# EasyEDA Pro project rocker.eprj

# Schematic Schematic1
Create Date: 2024-03-17; Page Name: P1; Project Name: 1919810; Schematic Name: Schematic1; Update Date: 2024-03-17; Company: 嘉立创EDA; Page Size: A4; Version: V1.0
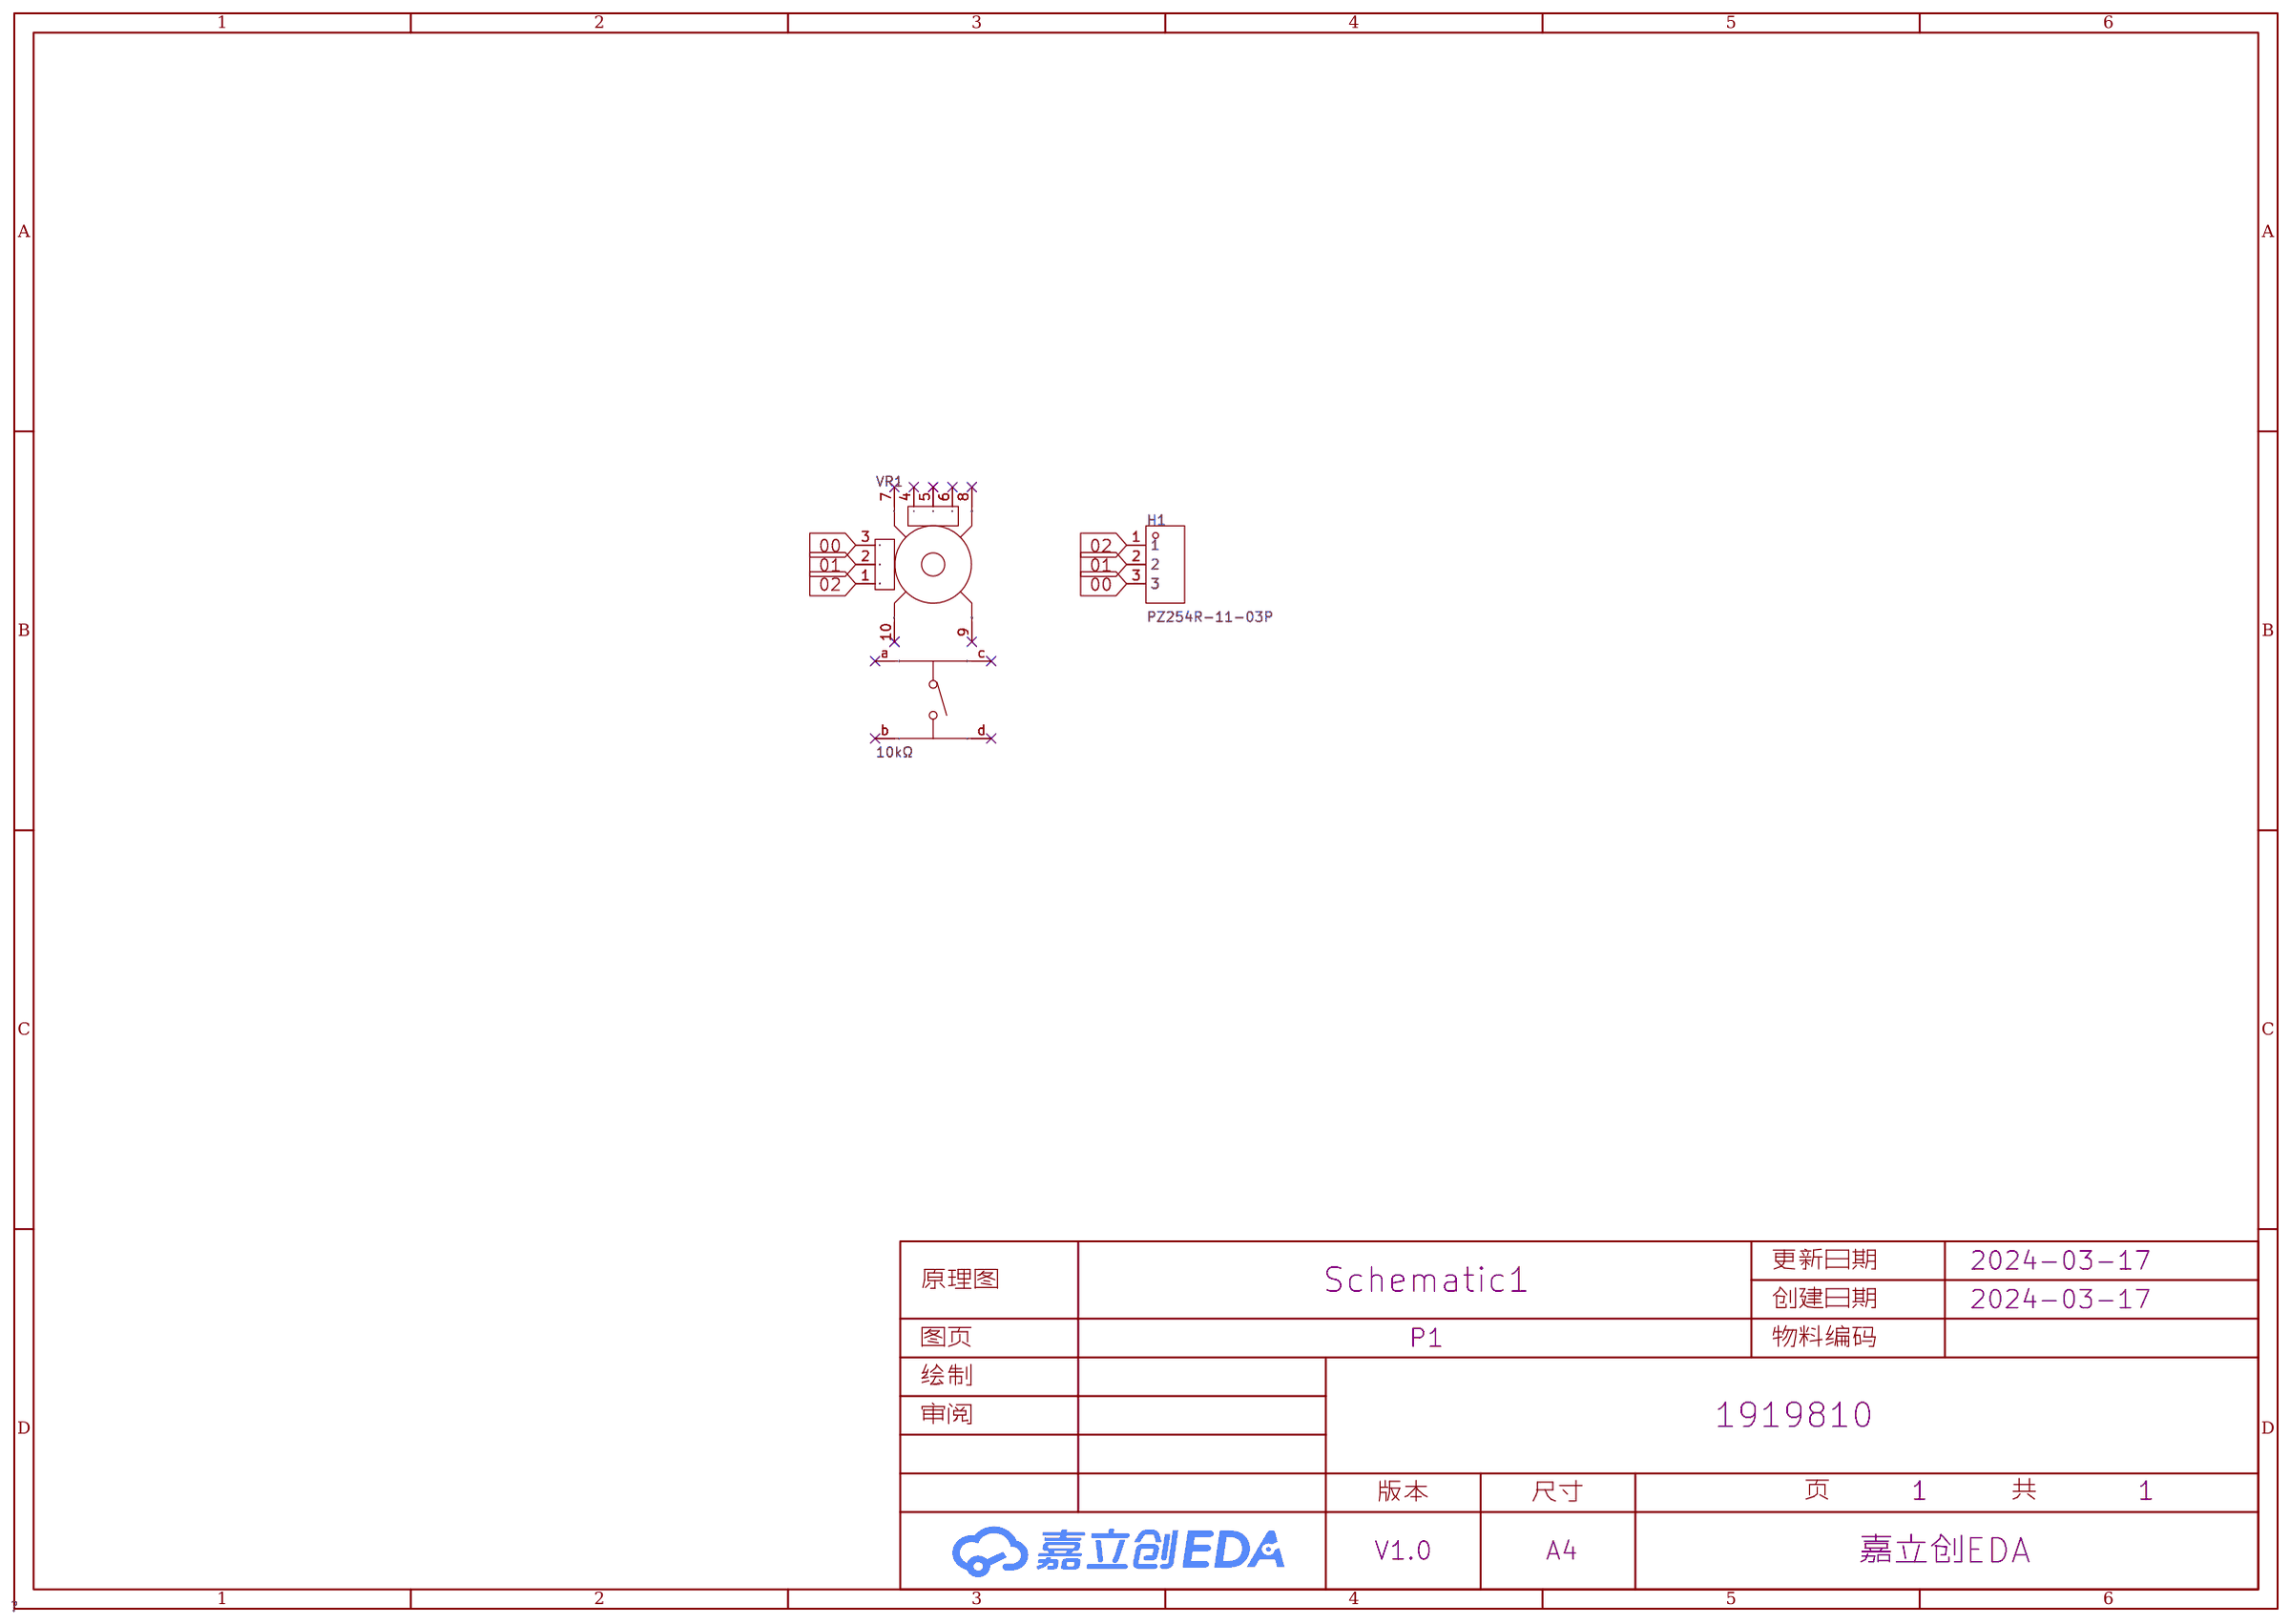
[diagram p0: schematic sheet]

## Parts
H1  PZ254R-11-03P  [HDR-TH_3P-P2.54-H-M-W10.4]
VR1  10kΩ  [SW-TH_RKJXV1224005]

## Library data of the parts
H1 = PZ254R-11-03P: 插针结构:1x3P;间距:2.54mm;行距:-;圆针/方针:方针;安装类型:弯插;排数:单排;总PIN位数:3P;额定电流:-;额定电压:-;配合针长度:6mm;塑高:2.5mm;触头材质:黄铜;触头镀层:-;工作温度范围:-40℃~+105℃;颜色:黑色;; LCSC Part Name: 间距:2.54mm 1x3P 弯插 方针; Supplier Part: C492411; Manufacturer: XFCN(兴飞); Supplier Footprint: 弯插,P=2.54mm; JLCPCB Part Class: 扩展库; Datasheet: https://atta.szlcsc.com/upload/public/pdf/source/20200309/C492411_5256E8AAA7569F6D33B6ADBFAE4F2888.pdf; Supplier: LCSC; Pin Structure: 1x3P; Pitch: 2.54mm; Circluar Pins/Square Pins: 方针; Mounting Type: 弯插; Number of Rows: 单排; Number of Pins: 3P; Length of Mating Pin: 6mm; Insulation Height: 2.5mm; Contact Material: 黄铜; Operating Temperature Range: -40℃~+105℃; Color: 黑色
VR1 = RKJXV122400R: 阻值:10kΩ;精度:±5%;功率:125mW;; LCSC Part Name: 10kΩ ±5%; Supplier Part: C918854; Manufacturer: ALPSALPINE(阿尔卑斯阿尔派); Supplier Footprint: 插件; JLCPCB Part Class: 扩展库; Datasheet: https://atta.szlcsc.com/upload/public/pdf/source/20201117/C918854_AB501B8475748C966C0BA48728F1CF03.pdf; Supplier: LCSC; Tolerance: ±5%; Rated Voltage: 5V; Power(Watts): 125mW

## Nets
00: H1.3 VR1.3(A)
01: H1.2 VR1.2(DTA)
02: H1.1 VR1.1(B)

Not connected (* = marked no-connect by the designer): VR1 4(A)* 5(DTA)* 6(B)* 7(GND)* 8(GND)* 9(GND)* 10(GND)* a* b* c* d*

# Board PCB1
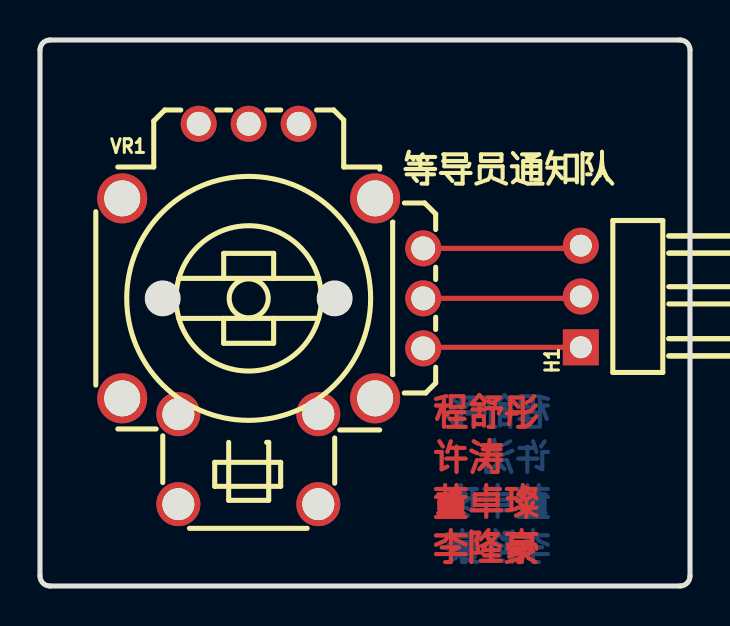
[diagram p1: board, top side]
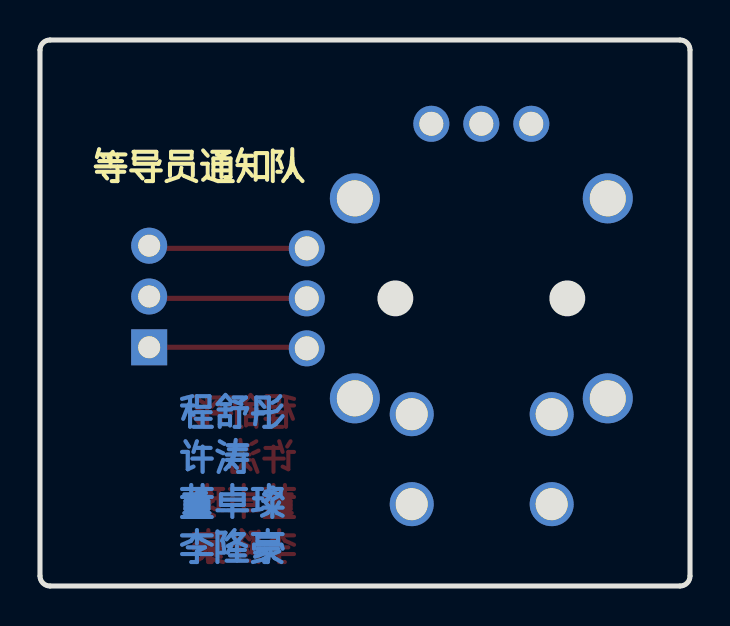
[diagram p2: board, bottom side, seen from below]

Outline 32.51 x 27.3 mm; copper layers: Top Layer, Bottom Layer. Coordinates in mm from the lower left corner of the outline.
Outline path: 0,26.8 0,0.5 arc(0.15,0.15) 0.5,0 32.01,0 arc(32.37,0.15) 32.51,0.5 32.51,26.8 arc(32.37,27.16) 32.01,27.3 0.5,27.3 arc(0.15,27.16) 0,26.8
Stack: Top Layer 0.035mm / Dielectric1 1.51mm FR4 er 4.5 / Bottom Layer 0.035mm

## Design rules (mm)
template: JLCPCB Capability(Two Layers Board)
spacing copperThickness1oz (default): track to track 0.102, other pairs 0.152 to 0.3
spacing copperThickness2oz: track to track 0.203, other pairs 0.152 to 0.3
track width copperThickness1oz (default): min 0.127, default 0.254, max 2.54
track width copperThickness2oz: min 0.203, default 0.254, max 2.54
differential pair differentialPair (default): width min 0.127, default 0.254, max 2.54; gap min 0.152, default 0.152
via viaSize (default): diameter min 0.5, default 0.61, max 10; hole min 0.3, default 0.305, max 6.3

## Placement (name value [footprint] x y rotation side)
H1  PZ254R-11-03P  [HDR-TH_3P-P2.54-H-M-W10.4]  27.05 14.48 90 top
VR1  10kΩ  [SW-TH_RKJXV1224005]  11.64 13.6 0 top

## Footprints (pads in the part's own frame, mm; a bottom-side part is the same pattern mirrored in y, then rotated)
HDR-TH_3P-P2.54-H-M-W10.4
  rect 1.8x1.8 hole 1.1: 1(-2.54,0)
  round 1.8 hole 1.1: 2(0,0) 3(2.54,0)
SW-TH_RKJXV1224005
  round 1.8 hole 1.2: 1(7.527,-1.719) 2(7.527,0.781) 3(7.527,3.281) 4(1.298,9.511) 5(-1.202,9.511) 6(-3.703,9.511)
  round 2.5 hole 1.8: 7(-7.527,5.781) 8(-7.527,-4.219) 9(5.122,-4.219) 10(5.122,5.781)
  round 2.2 hole 1.6: a(-4.721,-5.011) b(-4.721,-9.511) c(2.279,-5.011) d(2.279,-9.511)

## Nets
As in the schematic.

Pads without a net: VR1 4 5 6 7 8 9 10 a b c d

## Routing (per net, layer and track width the routed paths; a pad name or vN(x,y) marks a point on that pad's centre or on a via; arc(x,y) is an arc through that point)
00: length 7.9
  Top Layer w0.254: VR1.3 26.92,16.88 H1.3
01: length 7.9
  Top Layer w0.254: H1.2 26.96,14.38 VR1.2
02: length 7.9
  Top Layer w0.254: VR1.1 19.22,11.94 H1.1

## Text on the board
Bottom Layer: 程舒彤 / 许涛 / 董卓璨 / 李隆豪
Bottom Silkscreen Layer: 等导员通知队
Top Layer: 程舒彤 / 许涛 / 董卓璨 / 李隆豪
Top Silkscreen Layer: 等导员通知队
